# Altium schematic sheet Top-Level.SchDoc
size A; SheetNumber: 1; SheetTotal: 10
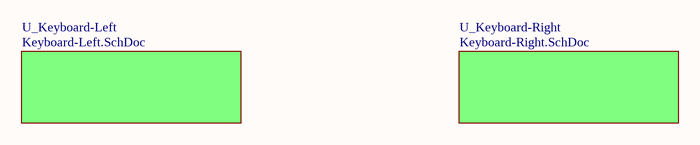
[diagram p0: Top-Level.SchDoc]

## Sub-sheets
U_Keyboard-Left = Keyboard-Left.SchDoc: no entries
U_Keyboard-Right = Keyboard-Right.SchDoc: no entries